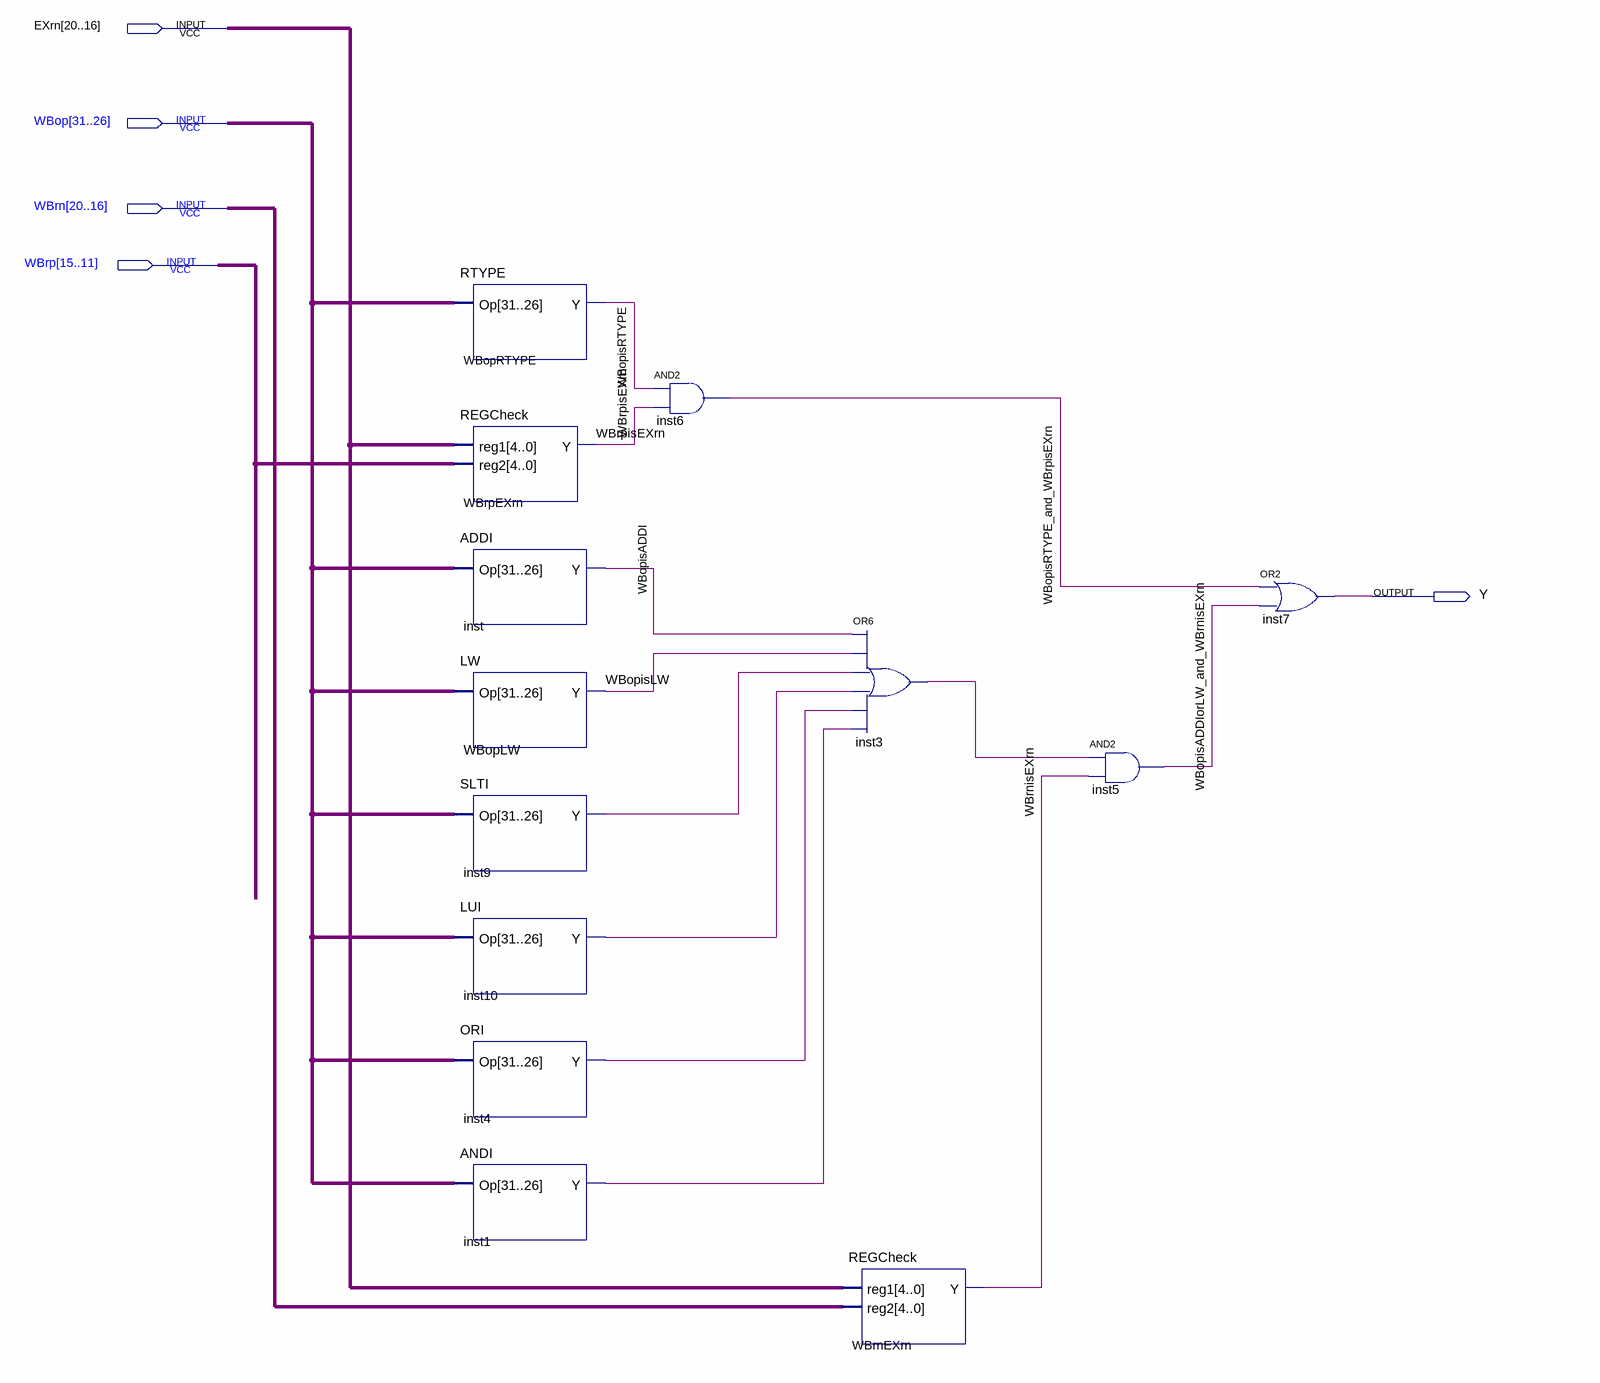
[diagram p0: schematic sheet]
// Quartus schematic ForwardBfromWBtoEX.bdf as structural Verilog: 13 symbols, 5 pins
module ForwardBfromWBtoEX (
  input  [20:16] EXrn,
  input  [31:26] WBop,
  input  [20:16] WBrn,
  input  [15:11] WBrp,
  output Y
);

  wire inst1_y, inst3_out, inst4_y, inst9_y, inst10_y, WBopisADDI, WBopisADDIorLW_and_WBrnisEXrn, WBopisLW,
       WBopisRTYPE, WBopisRTYPE_and_WBrpisEXrn, WBrnisEXrn, WBrpisEXrn;

  RTYPE WBopRTYPE (.Op(WBop), .Y(WBopisRTYPE));
  REGCheck WBrpEXrn (.reg1(EXrn), .reg2(WBrp), .Y(WBrpisEXrn));
  ADDI inst (.Op(WBop), .Y(WBopisADDI));
  LW WBopLW (.Op(WBop), .Y(WBopisLW));
  SLTI inst9 (.Op(WBop), .Y(inst9_y));
  LUI inst10 (.Op(WBop), .Y(inst10_y));
  ORI inst4 (.Op(WBop), .Y(inst4_y));
  ANDI inst1 (.Op(WBop), .Y(inst1_y));
  and inst6 (WBopisRTYPE_and_WBrpisEXrn, WBopisRTYPE, WBrpisEXrn);
  or inst3 (inst3_out, WBopisADDI, WBopisLW, inst9_y, inst10_y, inst4_y, inst1_y);
  REGCheck WBrnEXrn (.reg1(EXrn), .reg2(WBrn), .Y(WBrnisEXrn));
  and inst5 (WBopisADDIorLW_and_WBrnisEXrn, inst3_out, WBrnisEXrn);
  or inst7 (Y, WBopisRTYPE_and_WBrpisEXrn, WBopisADDIorLW_and_WBrnisEXrn);
endmodule
